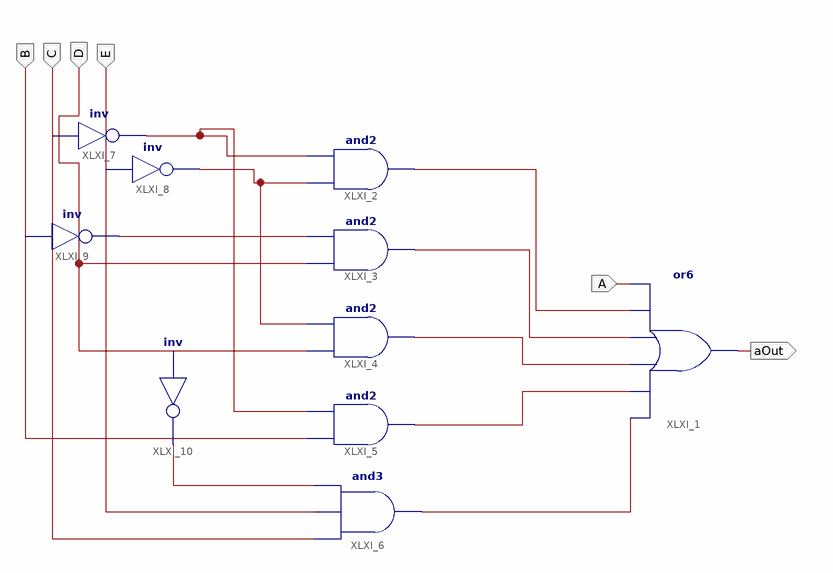
[diagram p0: schematic sheet 1]
// Xilinx ISE schematic a.sch (xa9500xl) as structural Verilog: 10 symbols, 6 ports
module a (
  input  A,
  input  E,
  input  B,
  input  C,
  input  D,
  output aOut
);

  wire XLXN_4, XLXN_5, XLXN_6, XLXN_7, XLXN_8, XLXN_23, XLXN_26, XLXN_27, XLXN_28;

  or XLXI_1 (aOut, XLXN_4, XLXN_5, XLXN_6, XLXN_7, XLXN_8, A);
  and XLXI_2 (XLXN_8, XLXN_26, XLXN_23);
  and XLXI_3 (XLXN_7, D, XLXN_27);
  and XLXI_4 (XLXN_6, D, XLXN_26);
  and XLXI_5 (XLXN_5, B, XLXN_23);
  and XLXI_6 (XLXN_4, C, E, XLXN_28);
  not XLXI_7 (XLXN_23, C);
  not XLXI_8 (XLXN_26, E);
  not XLXI_9 (XLXN_27, B);
  not XLXI_10 (XLXN_28, D);
endmodule
